# Altium project 8500_ADC.PrjPCB
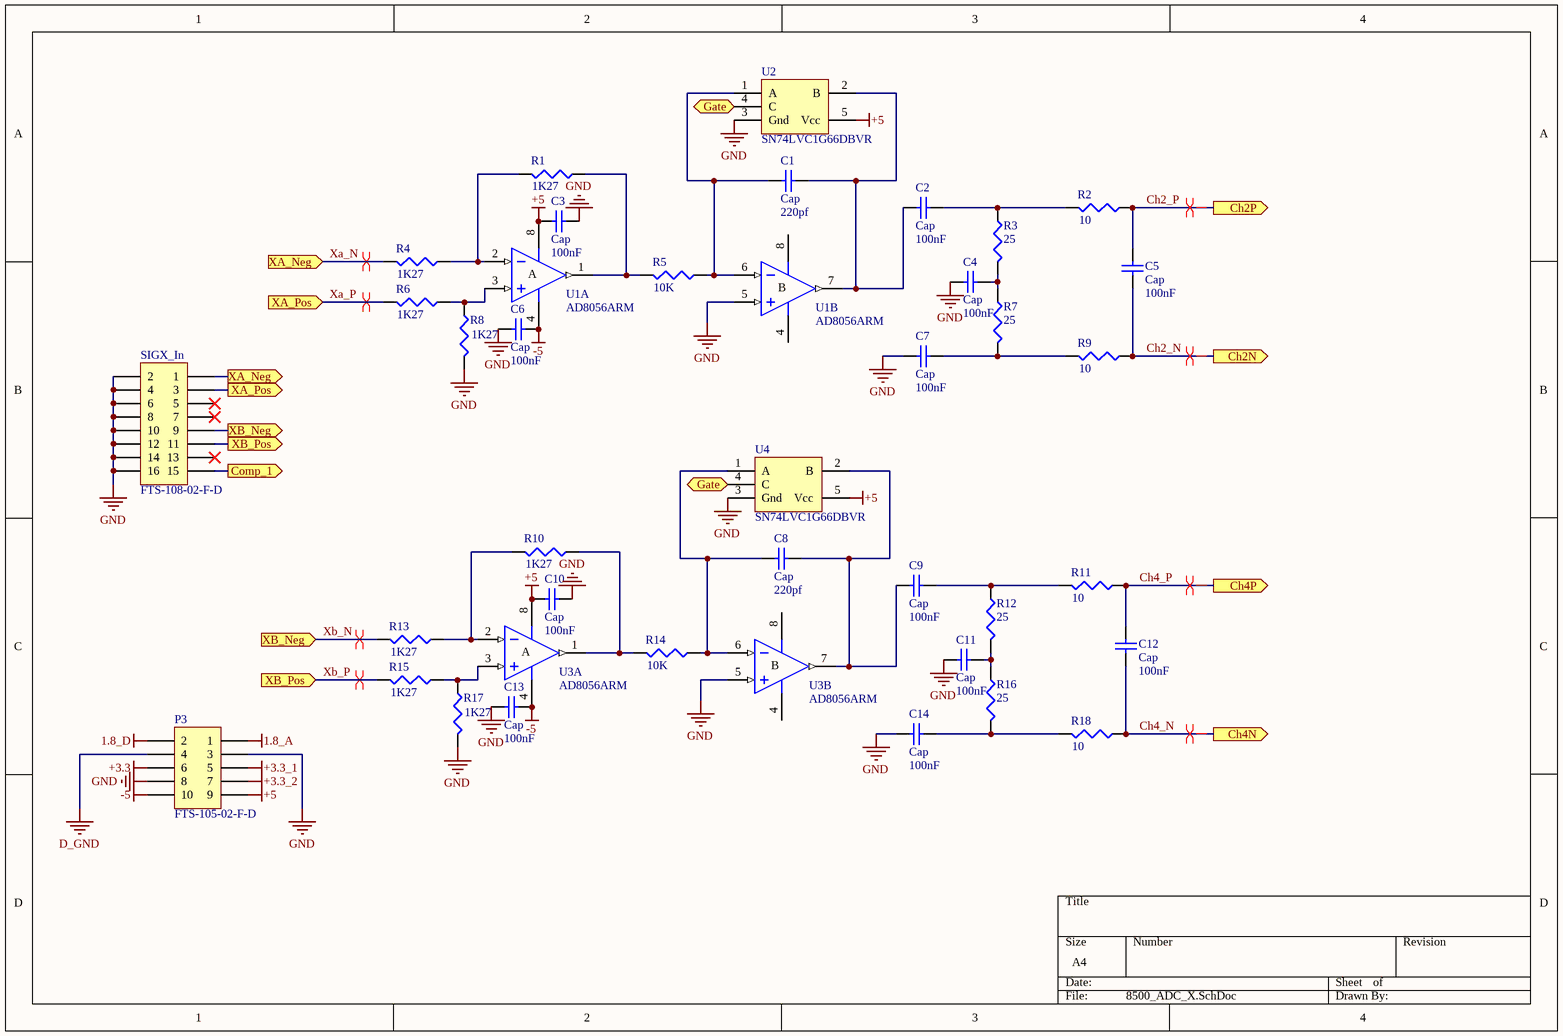
[diagram p0: 8500_ADC_X.SchDoc]
3 sheets, 92 parts. Net scope: flat (ports and power ports of the same name join across sheets).
Board file: 8500_ADC_pcb.PcbDoc
Sheets:
  8500_ADC_X.SchDoc
  8500_ADC_Y.SchDoc
  8500_ADC.SchDoc

## Sheet 8500_ADC_X.SchDoc
size A4

### Parts
C1  Cap  value 220pf  [0402]
C2  Cap  value 100nF  [0402]
C3  Cap  value 100nF  [0402]
C4  Cap  value 100nF  [0402]
C5  Cap  value 100nF  [0402]
C6  Cap  value 100nF  [0402]
C7  Cap  value 100nF  [0402]
C8  Cap  value 220pf  [0402]
C9  Cap  value 100nF  [0402]
C10  Cap  value 100nF  [0402]
C11  Cap  value 100nF  [0402]
C12  Cap  value 100nF  [0402]
C13  Cap  value 100nF  [0402]
C14  Cap  value 100nF  [0402]
P3  FTS-105-02-F-D  [MHDR2X5]
R1  value 1K27  [0402]  (hidden comment: Res3)
R2  value 10  [0402]  (hidden comment: Res3)
R3  value 25  [0402]  (hidden comment: Res3)
R4  value 1K27  [0402]  (hidden comment: Res3)
R5  value 10K  [0402]  (hidden comment: Res3)
R6  value 1K27  [0402]  (hidden comment: Res3)
R7  value 25  [0402]  (hidden comment: Res3)
R8  value 1K27  [0402]  (hidden comment: Res3)
R9  value 10  [0402]  (hidden comment: Res3)
R10  value 1K27  [0402]  (hidden comment: Res3)
R11  value 10  [0402]  (hidden comment: Res3)
R12  value 25  [0402]  (hidden comment: Res3)
R13  value 1K27  [0402]  (hidden comment: Res3)
R14  value 10K  [0402]  (hidden comment: Res3)
R15  value 1K27  [0402]  (hidden comment: Res3)
R16  value 25  [0402]  (hidden comment: Res3)
R17  value 1K27  [0402]  (hidden comment: Res3)
R18  value 10  [0402]  (hidden comment: Res3)
SIGX_In  FTS-108-02-F-D  [MHDR2X8]
U1  AD8056ARM  [RM-8]  (parts A,B of 2)
U2  SN74LVC1G66DBVR  [SOT23-5]
U3  AD8056ARM  [RM-8]  (parts A,B of 2)
U4  SN74LVC1G66DBVR  [SOT23-5]

### Ports
Ch2N (out), Ch2P (out), Ch4N (out), Ch4P (out), Comp_1 (out), Gate (out), XA_Neg (in), XA_Neg (out), XA_Pos (in), XA_Pos (out), XB_Neg (in), XB_Neg (out), XB_Pos (in), XB_Pos (out)

### Nets
1.8_A: P3.1
1.8_D: P3.2
+3.3: P3.6
+3.3_1: P3.5
+3.3_2: P3.7
+5: C3.1 C10.1 P3.9 U1.8(V+) U2.5(Vcc) U3.8(V+) U4.5(Vcc)
-5: C6.2 C13.2 P3.10 U1.4(V-) U3.4(V-)
D_GND: P3.4
GND: C3.2 C4.1 C6.1 C7.1 C10.2 C11.1 C13.1 C14.1 P3.3 P3.8 R8.2 R17.2 SIGX_In.2 SIGX_In.4 SIGX_In.6 SIGX_In.8 SIGX_In.10 SIGX_In.12 SIGX_In.14 SIGX_In.16 U1.5(IN+) U2.3(Gnd) U3.5(IN+) U4.3(Gnd)
Ch2_N: C5.1 R9.1 ; port Ch2N
Ch2_P: C5.2 R2.1 ; port Ch2P
Ch4_N: C12.1 R18.1 ; port Ch4N
Ch4_P: C12.2 R11.1 ; port Ch4P
Xa_N: R4.2 SIGX_In.1 ; port XA_Neg
Xa_P: R6.2 SIGX_In.3 ; port XA_Pos
Xb_N: R13.2 SIGX_In.9 ; port XB_Neg
Xb_P: R15.2 SIGX_In.11 ; port XB_Pos
NetC1_1: C1.1 R5.1 U1.6(IN-) U2.1(A)
NetC1_2: C1.2 C2.1 U1.7(OUT) U2.2(B)
NetC2_2: C2.2 R2.2 R3.1
NetC4_2: C4.2 R3.2 R7.1
NetC7_2: C7.2 R7.2 R9.2
NetC8_1: C8.1 R14.1 U3.6(IN-) U4.1(A)
NetC8_2: C8.2 C9.1 U3.7(OUT) U4.2(B)
NetC9_2: C9.2 R11.2 R12.1
NetC11_2: C11.2 R12.2 R16.1
NetC14_2: C14.2 R16.2 R18.2
NetR1_1: R1.1 R5.2 U1.1(OUT)
NetR1_2: R1.2 R4.1 U1.2(IN-)
NetR6_1: R6.1 R8.1 U1.3(IN+)
NetR10_1: R10.1 R14.2 U3.1(OUT)
NetR10_2: R10.2 R13.1 U3.2(IN-)
NetR15_1: R15.1 R17.1 U3.3(IN+)
NetSIGX_41: U2.4(C) U4.4(C) ; port Gate
NetSIGX_47: SIGX_In.15 ; port Comp_1

Not connected (* = marked no-connect by the designer): SIGX_In 5* 7* 13*

### Layout directives
differential pair: Ch2_N, Ch2_P, Ch4_N, Ch4_P, Xa_N, Xa_P, Xb_N, Xb_P

### Notes on the sheet
- (in symbol AD8056ARM, part A) A
- (in symbol AD8056ARM, part B) B

### Library data of the parts
C1-C14 = Cap: Capacitor; Published: 8-Jun-2000; LatestRevisionDate: 17-Jul-2002; LatestRevisionNote: Re-released for DXP Platform.; PackageReference: RAD-0.3; Publisher: Altium Limited; PackageDescription: Radial Cap, Thru-Hole; 2 Leads; 0.3 in Pin Spacing
P3 = FTR-105-01-D
R1-R18 = Res3: Resistor; Published: 8-Jun-2000; LatestRevisionDate: 29-May-2009; LatestRevisionNote: IPC-7351 Footprint Added.; PackageReference: J1-0603; Publisher: Altium Limited; PackageDescription: Chip Resistor
SIGX_In = FTR-108-01-D
U1 U3 = AD8056ARM: Low Cost, 300MHz Voltage Feedback Amplifier; Published: 8-Jun-2000; LatestRevisionDate: 04-Mar-2005; LatestRevisionNote: Stylized 3D Model Added, PCB footprint pad width decreased.; DatasheetVersion: REV. 0 1997; PackageVersion: 2004; PackageReference: RM-8; Publisher: Altium Limited; PackageDescription: Shrink Small Outline, MSOP; 8 Leads; Body Width 3 mm; Pitch 0.65 mm; Code_JEDEC: MO-187-AA; ComponentLink1Description: Manufacturer Link; ComponentLink1URL: http://www.analog.com/en/prod/0,,759_786_AD8055%2C00.html; ComponentLink2Description: Datasheet; ComponentLink2URL: http://www.analog.com/UploadedFiles/Data_Sheets/40402558757264AD8055_6_i.pdf

## Sheet 8500_ADC_Y.SchDoc
size A4
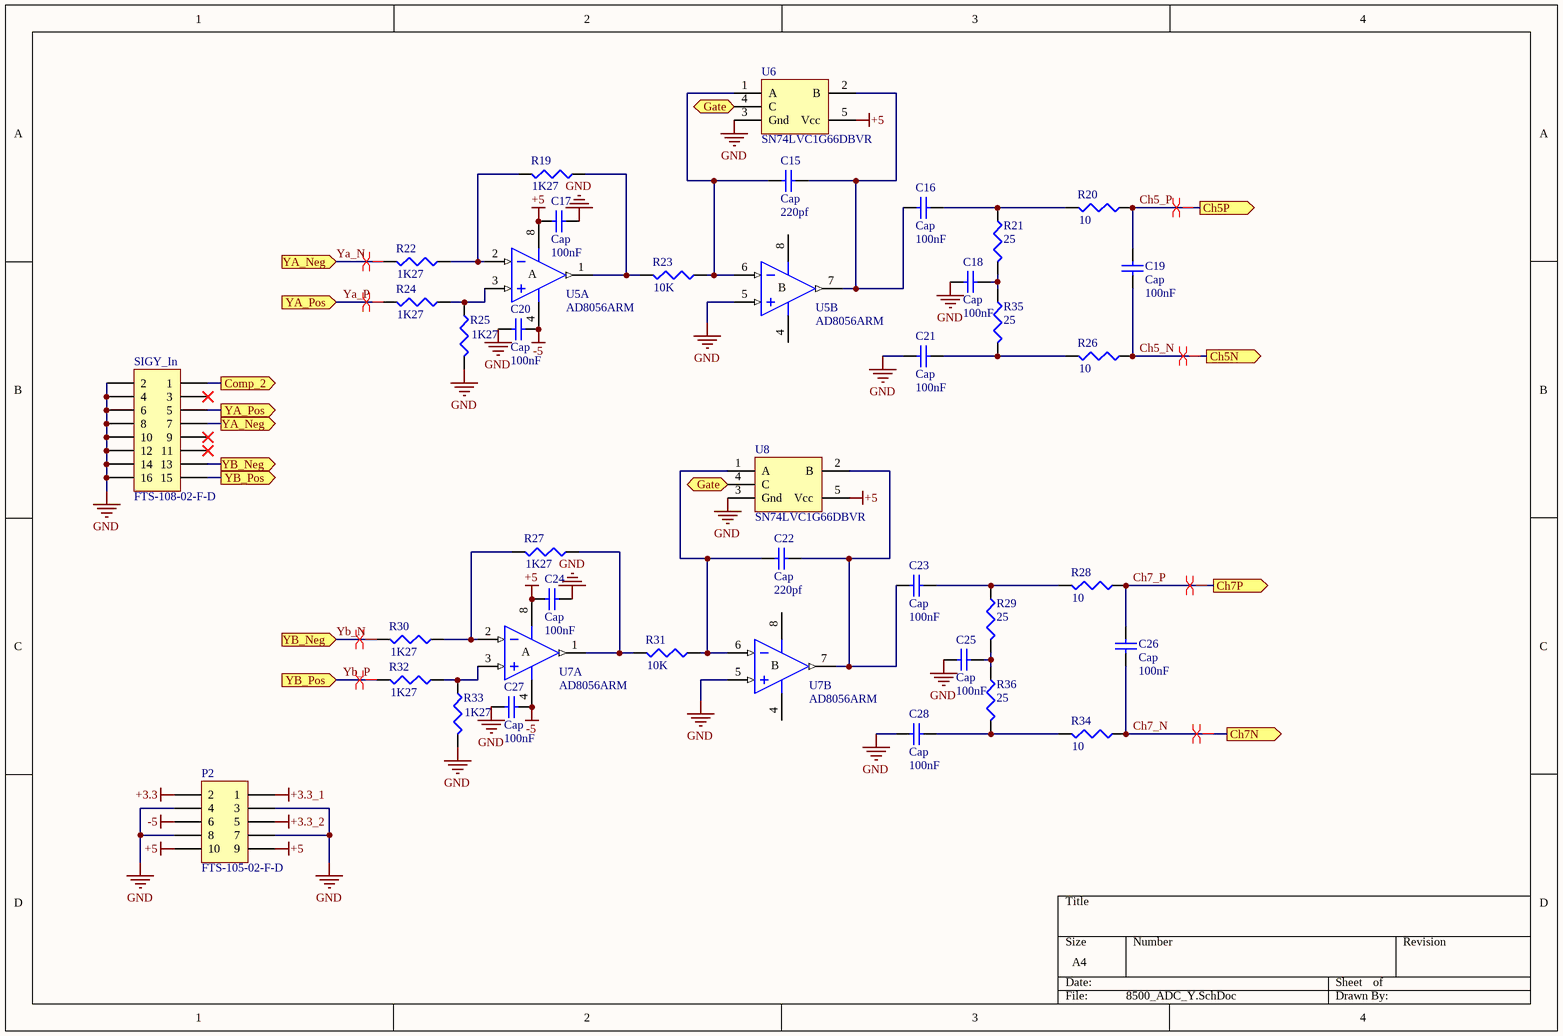
[diagram p1: 8500_ADC_Y.SchDoc]

### Parts
C15  Cap  value 220pf  [0402]
C16  Cap  value 100nF  [0402]
C17  Cap  value 100nF  [0402]
C18  Cap  value 100nF  [0402]
C19  Cap  value 100nF  [0402]
C20  Cap  value 100nF  [0402]
C21  Cap  value 100nF  [0402]
C22  Cap  value 220pf  [0402]
C23  Cap  value 100nF  [0402]
C24  Cap  value 100nF  [0402]
C25  Cap  value 100nF  [0402]
C26  Cap  value 100nF  [0402]
C27  Cap  value 100nF  [0402]
C28  Cap  value 100nF  [0402]
P2  FTS-105-02-F-D  [MHDR2X5]
R19  value 1K27  [0402]  (hidden comment: Res3)
R20  value 10  [0402]  (hidden comment: Res3)
R21  value 25  [0402]  (hidden comment: Res3)
R22  value 1K27  [0402]  (hidden comment: Res3)
R23  value 10K  [0402]  (hidden comment: Res3)
R24  value 1K27  [0402]  (hidden comment: Res3)
R25  value 1K27  [0402]  (hidden comment: Res3)
R26  value 10  [0402]  (hidden comment: Res3)
R27  value 1K27  [0402]  (hidden comment: Res3)
R28  value 10  [0402]  (hidden comment: Res3)
R29  value 25  [0402]  (hidden comment: Res3)
R30  value 1K27  [0402]  (hidden comment: Res3)
R31  value 10K  [0402]  (hidden comment: Res3)
R32  value 1K27  [0402]  (hidden comment: Res3)
R33  value 1K27  [0402]  (hidden comment: Res3)
R34  value 10  [0402]  (hidden comment: Res3)
R35  value 25  [0402]  (hidden comment: Res3)
R36  value 25  [0402]  (hidden comment: Res3)
SIGY_In  FTS-108-02-F-D  [MHDR2X8]
U5  AD8056ARM  [RM-8]  (parts A,B of 2)
U6  SN74LVC1G66DBVR  [SOT23-5]
U7  AD8056ARM  [RM-8]  (parts A,B of 2)
U8  SN74LVC1G66DBVR  [SOT23-5]

### Ports
Ch5N (out), Ch5P (out), Ch7N (out), Ch7P (out), Comp_2 (out), Gate (out), YA_Neg (in), YA_Neg (out), YA_Pos (in), YA_Pos (out), YB_Neg (in), YB_Neg (out), YB_Pos (in), YB_Pos (out)

### Nets
+3.3: P2.2
+3.3_1: P2.1
+3.3_2: P2.5
+5: C17.1 C24.1 P2.9 P2.10 U5.8(V+) U6.5(Vcc) U7.8(V+) U8.5(Vcc)
-5: C20.2 C27.2 P2.6 U5.4(V-) U7.4(V-)
GND: C17.2 C18.1 C20.1 C21.1 C24.2 C25.1 C27.1 C28.1 P2.3 P2.4 P2.7 P2.8 R25.2 R33.2 SIGY_In.2 SIGY_In.4 SIGY_In.6 SIGY_In.8 SIGY_In.10 SIGY_In.12 SIGY_In.14 SIGY_In.16 U5.5(IN+) U6.3(Gnd) U7.5(IN+) U8.3(Gnd)
Ch5_N: C19.1 R26.1 ; port Ch5N
Ch5_P: C19.2 R20.1 ; port Ch5P
Ch7_N: C26.1 R34.1 ; port Ch7N
Ch7_P: C26.2 R28.1 ; port Ch7P
Ya_N: R22.2 SIGY_In.7 ; port YA_Neg
Ya_P: R24.2 SIGY_In.5 ; port YA_Pos
Yb_N: R30.2 SIGY_In.13 ; port YB_Neg
Yb_P: R32.2 SIGY_In.15 ; port YB_Pos
NetC15_1: C15.1 R23.1 U5.6(IN-) U6.1(A)
NetC15_2: C15.2 C16.1 U5.7(OUT) U6.2(B)
NetC16_2: C16.2 R20.2 R21.1
NetC18_2: C18.2 R21.2 R35.1
NetC21_2: C21.2 R26.2 R35.2
NetC22_1: C22.1 R31.1 U7.6(IN-) U8.1(A)
NetC22_2: C22.2 C23.1 U7.7(OUT) U8.2(B)
NetC23_2: C23.2 R28.2 R29.1
NetC25_2: C25.2 R29.2 R36.1
NetC28_2: C28.2 R34.2 R36.2
NetR19_1: R19.1 R23.2 U5.1(OUT)
NetR19_2: R19.2 R22.1 U5.2(IN-)
NetR24_1: R24.1 R25.1 U5.3(IN+)
NetR27_1: R27.1 R31.2 U7.1(OUT)
NetR27_2: R27.2 R30.1 U7.2(IN-)
NetR32_1: R32.1 R33.1 U7.3(IN+)
NetSIGX_41: U6.4(C) U8.4(C) ; port Gate
NetSIGX_51: SIGY_In.1 ; port Comp_2

Not connected (* = marked no-connect by the designer): SIGY_In 3* 9* 11*

### Layout directives
differential pair: Ch5_N, Ch5_P, Ch7_N, Ch7_P, Ya_N, Ya_P, Yb_N, Yb_P

### Notes on the sheet
- (in symbol AD8056ARM, part A) A
- (in symbol AD8056ARM, part B) B

### Library data of the parts
C15-C28 = Cap: Capacitor; Published: 8-Jun-2000; LatestRevisionDate: 17-Jul-2002; LatestRevisionNote: Re-released for DXP Platform.; PackageReference: RAD-0.3; Publisher: Altium Limited; PackageDescription: Radial Cap, Thru-Hole; 2 Leads; 0.3 in Pin Spacing
P2 = FTR-105-01-D
R19-R36 = Res3: Resistor; Published: 8-Jun-2000; LatestRevisionDate: 29-May-2009; LatestRevisionNote: IPC-7351 Footprint Added.; PackageReference: J1-0603; Publisher: Altium Limited; PackageDescription: Chip Resistor
SIGY_In = FTR-108-01-D
U5 U7 = AD8056ARM: as U1 on sheet 8500_ADC_X; Published: 8-Jun-2000; LatestRevisionDate: 04-Mar-2005; LatestRevisionNote: Stylized 3D Model Added, PCB footprint pad width decreased.; DatasheetVersion: REV. 0 1997; PackageVersion: 2004; PackageReference: RM-8; Publisher: Altium Limited; PackageDescription: Shrink Small Outline, MSOP; 8 Leads; Body Width 3 mm; Pitch 0.65 mm; Code_JEDEC: MO-187-AA; ComponentLink1Description: Manufacturer Link; ComponentLink1URL: http://www.analog.com/en/prod/0,,759_786_AD8055%2C00.html; ComponentLink2Description: Datasheet; ComponentLink2URL: http://www.analog.com/UploadedFiles/Data_Sheets/40402558757264AD8055_6_i.pdf

## Sheet 8500_ADC.SchDoc
size A4
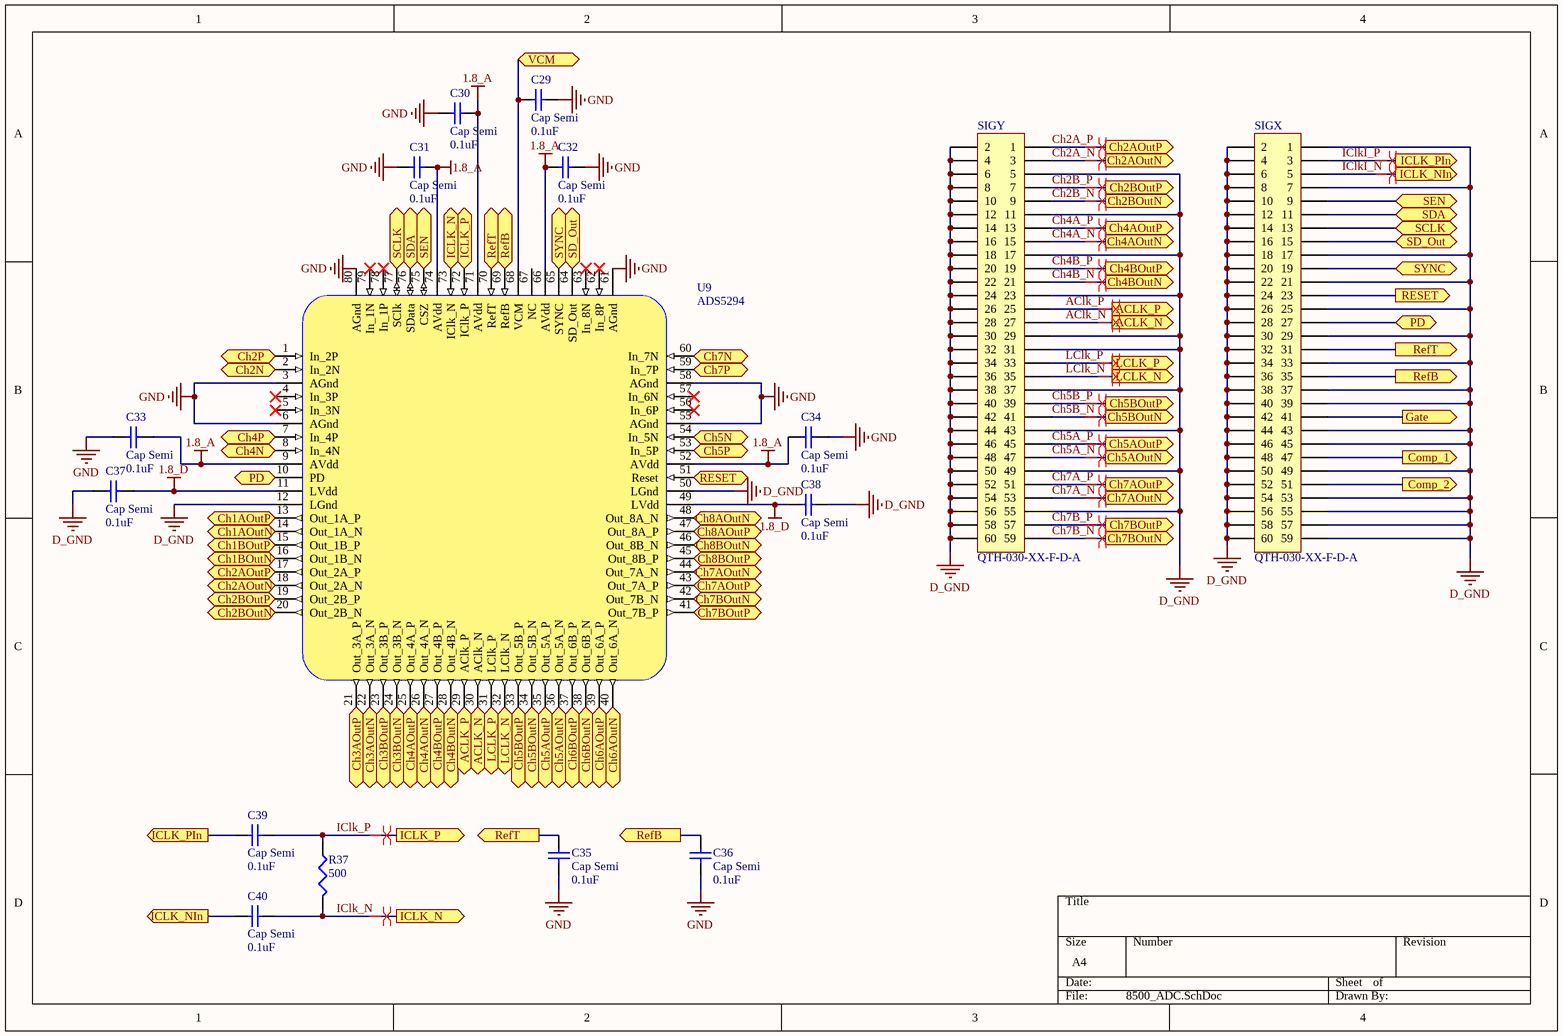
[diagram p2: 8500_ADC.SchDoc]

### Parts
C29  Cap Semi  value 0.1uF  [0402]
C30  Cap Semi  value 0.1uF  [0402]
C31  Cap Semi  value 0.1uF  [0402]
C32  Cap Semi  value 0.1uF  [0402]
C33  Cap Semi  value 0.1uF  [0402]
C34  Cap Semi  value 0.1uF  [0402]
C35  Cap Semi  value 0.1uF  [0402]
C36  Cap Semi  value 0.1uF  [0402]
C37  Cap Semi  value 0.1uF  [0402]
C38  Cap Semi  value 0.1uF  [0402]
C39  Cap Semi  value 0.1uF  [0402]
C40  Cap Semi  value 0.1uF  [0402]
R37  value 500  [0402]  (hidden comment: Res3)
SIGX  QTH-030-XX-F-D-A  [QTH-030-XX-D-A]
SIGY  QTH-030-XX-F-D-A  [QTH-030-XX-D-A]
U9  ADS5294  [PFP80_M]

### Ports
ACLK_N (out), ACLK_P (out), Ch1AOutN (out), Ch1AOutP (out), Ch1BOutN (out), Ch1BOutP (out), Ch2AOutN (out), Ch2AOutP (out), Ch2BOutN (out), Ch2BOutP (out), Ch2N (in), Ch2P (in), Ch3AOutN (out), Ch3AOutP (out), Ch3BOutN (out), Ch3BOutP (out), Ch4AOutN (out), Ch4AOutP (out), Ch4BOutN (out), Ch4BOutP (out), Ch4N (in), Ch4P (in), Ch5AOutN (out), Ch5AOutP (out), Ch5BOutN (out), Ch5BOutP (out), Ch5N (in), Ch5P (in), Ch6AOutN (out), Ch6AOutP (out), Ch6BOutN (out), Ch6BOutP (out), Ch7AOutN (out), Ch7AOutP (out), Ch7BOutN (out), Ch7BOutP (out), Ch7N (in), Ch7P (in), Ch8AOutN (out), Ch8AOutP (out), Ch8BOutN (out), Ch8BOutP (out), Comp_1 (out), Comp_2 (out), Gate (out), ICLK_N (in), ICLK_N (out), ICLK_NIn (out), ICLK_P (in), ICLK_P (out), ICLK_PIn (out), LCLK_N (out), LCLK_P (out), PD, RefB (in), RefB (out), RefT (in), RefT (out), RESET (in), RESET (out), SCLK (bidir), SD_Out, SDA (bidir), SEN (bidir), SYNC (bidir), VCM

### Nets
1.8_A: C30.1 C31.2 C32.1 C33.2 C34.1 U9.9(AVdd) U9.52(AVdd) U9.66(AVdd) U9.71(AVdd) U9.74(AVdd)
1.8_D: C37.2 C38.1 U9.11(LVdd) U9.49(LVdd)
D_GND: C37.1 C38.2 SIGX.1 SIGX.2 SIGX.4 SIGX.6 SIGX.7 SIGX.8 SIGX.10 SIGX.12 SIGX.14 SIGX.16 SIGX.17 SIGX.18 SIGX.20 SIGX.21 SIGX.22 SIGX.24 SIGX.25 SIGX.26 SIGX.28 SIGX.29 SIGX.30 SIGX.32 SIGX.33 SIGX.34 SIGX.36 SIGX.37 SIGX.38 SIGX.39 SIGX.40 SIGX.42 SIGX.43 SIGX.44 SIGX.45 SIGX.46 SIGX.48 SIGX.49 SIGX.50 SIGX.52 SIGX.53 SIGX.54 SIGX.55 SIGX.56 SIGX.57 SIGX.58 SIGX.59 SIGX.60 SIGY.2 SIGY.4 SIGY.5 SIGY.6 SIGY.8 SIGY.10 SIGY.11 SIGY.12 SIGY.14 SIGY.16 SIGY.17 SIGY.18 SIGY.20 SIGY.22 SIGY.23 SIGY.24 SIGY.26 SIGY.28 SIGY.29 SIGY.30 SIGY.31 SIGY.32 SIGY.34 SIGY.36 SIGY.37 SIGY.38 SIGY.40 SIGY.42 SIGY.43 SIGY.44 SIGY.46 SIGY.48 SIGY.49 SIGY.50 SIGY.52 SIGY.54 SIGY.55 SIGY.56 SIGY.58 SIGY.60 U9.12(LGnd) U9.50(LGnd)
GND: C29.1 C30.1 C31.1 C32.2 C33.1 C34.2 C35.2 C36.2 U9.3(AGnd) U9.6(AGnd) U9.55(AGnd) U9.58(AGnd) U9.61(AGnd) U9.80(AGnd)
AClk_N: SIGY.27 U9.30(AClk_N) ; port ACLK_N
AClk_P: SIGY.25 U9.29(AClk_P) ; port ACLK_P
Ch2_N: U9.2(In_2N) ; port Ch2N
Ch2_P: U9.1(In_2P) ; port Ch2P
Ch2A_N: SIGY.3 U9.18(Out_2A_N) ; port Ch2AOutN
Ch2A_P: SIGY.1 U9.17(Out_2A_P) ; port Ch2AOutP
Ch2B_N: SIGY.9 U9.20(Out_2B_N) ; port Ch2BOutN
Ch2B_P: SIGY.7 U9.19(Out_2B_P) ; port Ch2BOutP
Ch4_N: U9.8(In_4N) ; port Ch4N
Ch4_P: U9.7(In_4P) ; port Ch4P
Ch4A_N: SIGY.15 U9.26(Out_4A_N) ; port Ch4AOutN
Ch4A_P: SIGY.13 U9.25(Out_4A_P) ; port Ch4AOutP
Ch4B_N: SIGY.21 U9.28(Out_4B_N) ; port Ch4BOutN
Ch4B_P: SIGY.19 U9.27(Out_4B_P) ; port Ch4BOutP
Ch5_N: U9.54(In_5N) ; port Ch5N
Ch5_P: U9.53(In_5P) ; port Ch5P
Ch5A_N: SIGY.47 U9.36(Out_5A_N) ; port Ch5AOutN
Ch5A_P: SIGY.45 U9.35(Out_5A_P) ; port Ch5AOutP
Ch5B_N: SIGY.41 U9.34(Out_5B_N) ; port Ch5BOutN
Ch5B_P: SIGY.39 U9.33(Out_5B_P) ; port Ch5BOutP
Ch7_N: U9.60(In_7N) ; port Ch7N
Ch7_P: U9.59(In_7P) ; port Ch7P
Ch7A_N: SIGY.53 U9.44(Out_7A_N) ; port Ch7AOutN
Ch7A_P: SIGY.51 U9.43(Out_7A_P) ; port Ch7AOutP
Ch7B_N: SIGY.59 U9.42(Out_7B_N) ; port Ch7BOutN
Ch7B_P: SIGY.57 U9.41(Out_7B_P) ; port Ch7BOutP
IClk_N: C40.1 R37.2 U9.73(IClk_N) ; port ICLK_N
IClk_P: C39.1 R37.1 U9.72(IClk_P) ; port ICLK_P
IClkI_N: C40.2 SIGX.5 ; port ICLK_NIn
IClkI_P: C39.2 SIGX.3 ; port ICLK_PIn
LClk_N: SIGY.35 U9.32(LClk_N) ; port LCLK_N
LClk_P: SIGY.33 U9.31(LClk_P) ; port LCLK_P
NetC29_1: C29.1 U9.68(VCM) ; port VCM
NetC35_2: C35.2 SIGX.31 U9.70(RefT) ; port RefT
NetC36_2: C36.2 SIGX.35 U9.69(RefB) ; port RefB
NetSIGX_9: SIGX.9 U9.75(CSZ) ; port SEN
NetSIGX_11: SIGX.11 U9.76(SData) ; port SDA
NetSIGX_13: SIGX.13 U9.77(SClk) ; port SCLK
NetSIGX_15: SIGX.15 U9.64(SD_Out) ; port SD_Out
NetSIGX_19: SIGX.19 U9.65(SYNC) ; port SYNC
NetSIGX_23: SIGX.23 U9.51(Reset) ; port RESET
NetSIGX_27: SIGX.27 U9.10(PD) ; port PD
NetSIGX_41: SIGX.41 ; port Gate
NetSIGX_47: SIGX.47 ; port Comp_1
NetSIGX_51: SIGX.51 ; port Comp_2
NetU9_13: U9.13(Out_1A_P) ; port Ch1AOutP
NetU9_14: U9.14(Out_1A_N) ; port Ch1AOutN
NetU9_15: U9.15(Out_1B_P) ; port Ch1BOutP
NetU9_16: U9.16(Out_1B_N) ; port Ch1BOutN
NetU9_21: U9.21(Out_3A_P) ; port Ch3AOutP
NetU9_22: U9.22(Out_3A_N) ; port Ch3AOutN
NetU9_23: U9.23(Out_3B_P) ; port Ch3BOutP
NetU9_24: U9.24(Out_3B_N) ; port Ch3BOutN
NetU9_37: U9.37(Out_6B_P) ; port Ch6BOutP
NetU9_38: U9.38(Out_6B_N) ; port Ch6BOutN
NetU9_39: U9.39(Out_6A_P) ; port Ch6AOutP
NetU9_40: U9.40(Out_6A_N) ; port Ch6AOutN
NetU9_45: U9.45(Out_8B_P) ; port Ch8BOutP
NetU9_46: U9.46(Out_8B_N) ; port Ch8BOutN
NetU9_47: U9.47(Out_8A_P) ; port Ch8AOutP
NetU9_48: U9.48(Out_8A_N) ; port Ch8AOutN

Not connected (* = marked no-connect by the designer): U9 4(In_3P)* 5(In_3N)* 56(In_6P)* 57(In_6N)* 62(In_8P)* 63(In_8N)* 67(NC) 78(In_1P)* 79(In_1N)*

### Layout directives
differential pair: AClk_N, AClk_P, Ch2A_N, Ch2A_P, Ch2B_N, Ch2B_P, Ch4A_N, Ch4A_P, Ch4B_N, Ch4B_P, Ch5A_N, Ch5A_P, Ch5B_N, Ch5B_P, Ch7A_N, Ch7A_P, Ch7B_N, Ch7B_P, IClk_N, IClk_P, IClkI_N, IClkI_P, LClk_N, LClk_P

### Library data of the parts
C29-C40 = Cap Semi: Capacitor (Semiconductor SIM Model); Published: 8-Jun-2000; LatestRevisionDate: 29-May-2009; LatestRevisionNote: IPC-7351 Footprint Added.; PackageReference: C1206; Publisher: Altium Limited; PackageDescription: Chip Capacitor
R37 = Res3: Resistor; Published: 8-Jun-2000; LatestRevisionDate: 29-May-2009; LatestRevisionNote: IPC-7351 Footprint Added.; PackageReference: J1-0603; Publisher: Altium Limited; PackageDescription: Chip Resistor

## Nets that join several sheets
1.8_A: 8500_ADC_X (P3.1), 8500_ADC (10 pins)
1.8_D: 8500_ADC_X (P3.2), 8500_ADC (C37.2 C38.1 U9.11 U9.49)
+3.3: 8500_ADC_X (P3.6), 8500_ADC_Y (P2.2)
+3.3_1: 8500_ADC_X (P3.5), 8500_ADC_Y (P2.1)
+3.3_2: 8500_ADC_X (P3.7), 8500_ADC_Y (P2.5)
+5: 8500_ADC_X (7 pins), 8500_ADC_Y (8 pins)
-5: 8500_ADC_X (5 pins), 8500_ADC_Y (5 pins)
D_GND: 8500_ADC_X (P3.4), 8500_ADC (90 pins)
GND: 8500_ADC_X (24 pins), 8500_ADC_Y (26 pins), 8500_ADC (14 pins)
Ch2_N: 8500_ADC_X (C5.1 R9.1), 8500_ADC (U9.2)
Ch2_P: 8500_ADC_X (C5.2 R2.1), 8500_ADC (U9.1)
Ch4_N: 8500_ADC_X (C12.1 R18.1), 8500_ADC (U9.8)
Ch4_P: 8500_ADC_X (C12.2 R11.1), 8500_ADC (U9.7)
Ch5_N: 8500_ADC_Y (C19.1 R26.1), 8500_ADC (U9.54)
Ch5_P: 8500_ADC_Y (C19.2 R20.1), 8500_ADC (U9.53)
Ch7_N: 8500_ADC_Y (C26.1 R34.1), 8500_ADC (U9.60)
Ch7_P: 8500_ADC_Y (C26.2 R28.1), 8500_ADC (U9.59)
NetSIGX_41: 8500_ADC_X (U2.4 U4.4), 8500_ADC_Y (U6.4 U8.4), 8500_ADC (SIGX.41)
NetSIGX_47: 8500_ADC_X (SIGX_In.15), 8500_ADC (SIGX.47)
NetSIGX_51: 8500_ADC_Y (SIGY_In.1), 8500_ADC (SIGX.51)